# Altium schematic sheet PCH_MainBoard.SchDoc: Mainboard PCH Doc
size A3; SheetNumber: 1; SheetTotal: 13
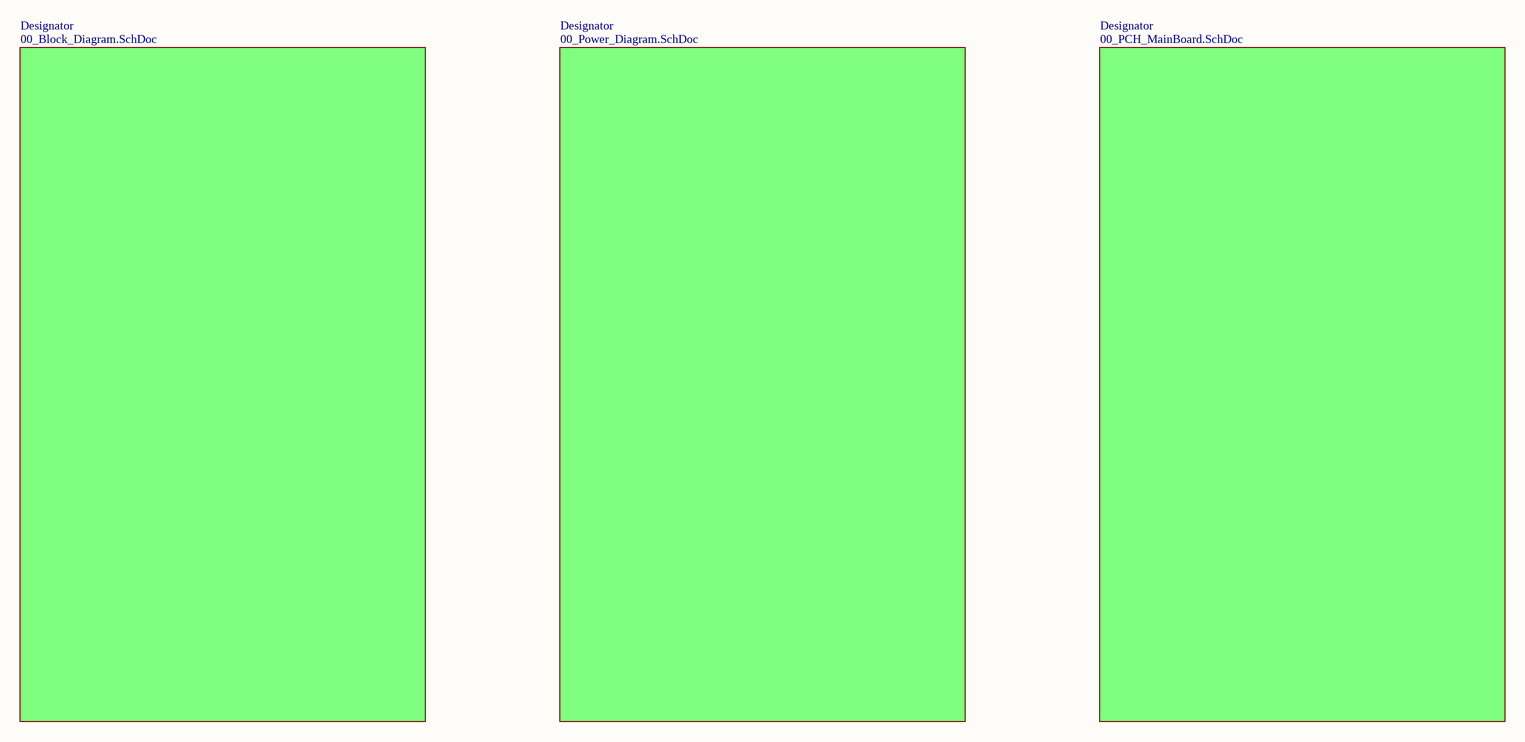
[diagram p0: PCH_MainBoard.SchDoc]

## Sub-sheets
Designator = 00_Block_Diagram.SchDoc: no entries
Designator = 00_Power_Diagram.SchDoc: no entries
Designator = 00_PCH_MainBoard.SchDoc: no entries

## Notes on the sheet
- APPROVALS
- DATE
- PROJECT
- BOM:
- REFERENCE DOCUMENTS
- TITLE
- PROJECT REVISION
- DOCUMENT REVISION
- ASSY DWG:
- FAB DWG:
- PCB DWG:
- SIZE:
- A3
- FILE NAME:
- REV
- SHEET
- OF